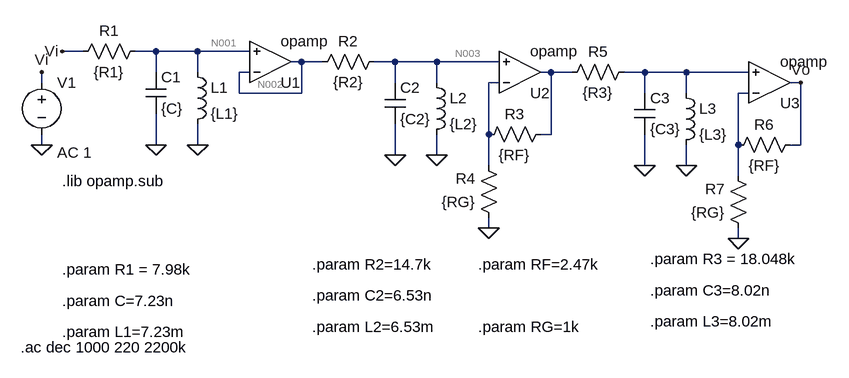
[diagram p0: schematic circuito_pasivo (copy).asc]
circuito_pasivo (copy).asc, the LTspice schematic file:
Version 4
SHEET 1 1120 680
WIRE -16 96 -48 96
WIRE 96 96 64 96
WIRE 160 96 96 96
WIRE 240 96 160 96
WIRE 320 112 304 112
WIRE 352 112 320 112
WIRE 464 112 432 112
WIRE 528 112 464 112
WIRE 624 112 528 112
WIRE 96 128 96 96
WIRE 160 128 160 96
WIRE 240 128 224 128
WIRE 704 128 688 128
WIRE 736 128 704 128
WIRE 848 128 816 128
WIRE 912 128 848 128
WIRE 1008 128 912 128
WIRE -80 144 -80 128
WIRE 464 144 464 112
WIRE 528 144 528 112
WIRE 624 144 608 144
WIRE 1088 144 1072 144
WIRE 224 160 224 128
WIRE 320 160 320 112
WIRE 320 160 224 160
WIRE 848 160 848 128
WIRE 912 160 912 128
WIRE 1008 160 992 160
WIRE 608 224 608 144
WIRE 704 224 704 128
WIRE 704 224 688 224
WIRE -80 240 -80 224
WIRE 96 240 96 192
WIRE 160 240 160 208
WIRE 992 240 992 160
WIRE 1088 240 1088 144
WIRE 1088 240 1072 240
WIRE 464 256 464 208
WIRE 528 256 528 224
WIRE 608 272 608 224
WIRE 848 272 848 224
WIRE 912 272 912 240
WIRE 992 288 992 240
WIRE 608 368 608 352
WIRE 992 384 992 368
FLAG 96 240 0
FLAG 160 240 0
FLAG 464 256 0
FLAG 528 256 0
FLAG 608 368 0
FLAG 848 272 0
FLAG 912 272 0
FLAG 992 384 0
FLAG 1088 144 Vo
FLAG -80 240 0
FLAG -80 128 Vi
FLAG -48 96 Vi
SYMBOL res 80 80 R90
WINDOW 0 0 56 VBottom 2
WINDOW 3 32 56 VTop 2
SYMATTR InstName R1
SYMATTR Value {R1}
SYMBOL cap 80 128 R0
SYMATTR InstName C1
SYMATTR Value {C}
SYMBOL ind 144 112 R0
SYMATTR InstName L1
SYMATTR Value {L1}
SYMBOL OpAmps\\opamp 272 176 M180
SYMATTR InstName U1
SYMBOL res 448 96 R90
WINDOW 0 0 56 VBottom 2
WINDOW 3 32 56 VTop 2
SYMATTR InstName R2
SYMATTR Value {R2}
SYMBOL cap 448 144 R0
SYMATTR InstName C2
SYMATTR Value {C2}
SYMBOL ind 512 128 R0
SYMATTR InstName L2
SYMATTR Value {L2}
SYMBOL OpAmps\\opamp 656 192 M180
SYMATTR InstName U2
SYMATTR SpiceLine Aol=1000K
SYMBOL res 704 208 R90
WINDOW 0 0 56 VBottom 2
WINDOW 3 32 56 VTop 2
SYMATTR InstName R3
SYMATTR Value {RF}
SYMBOL res 624 368 R180
WINDOW 0 36 76 Left 2
WINDOW 3 36 40 Left 2
SYMATTR InstName R4
SYMATTR Value {RG}
SYMBOL res 832 112 R90
WINDOW 0 0 56 VBottom 2
WINDOW 3 32 56 VTop 2
SYMATTR InstName R5
SYMATTR Value {R3}
SYMBOL cap 832 160 R0
SYMATTR InstName C3
SYMATTR Value {C3}
SYMBOL ind 896 144 R0
SYMATTR InstName L3
SYMATTR Value {L3}
SYMBOL OpAmps\\opamp 1040 208 M180
SYMATTR InstName U3
SYMATTR SpiceLine Aol=1000K
SYMBOL res 1088 224 R90
WINDOW 0 0 56 VBottom 2
WINDOW 3 32 56 VTop 2
SYMATTR InstName R6
SYMATTR Value {RF}
SYMBOL res 1008 384 R180
WINDOW 0 36 76 Left 2
WINDOW 3 36 40 Left 2
SYMATTR InstName R7
SYMATTR Value {RG}
SYMBOL voltage -80 128 R0
WINDOW 123 24 124 Left 2
WINDOW 39 0 0 Left 0
SYMATTR Value2 AC 1
SYMATTR InstName V1
SYMATTR Value ""
TEXT -48 296 Left 2 !.lib opamp.sub
TEXT -48 432 Left 2 !.param R1 = 7.98k
TEXT -48 480 Left 2 !.param C=7.23n
TEXT -48 528 Left 2 !.param L1=7.23m
TEXT 336 424 Left 2 !.param R2=14.7k
TEXT 336 472 Left 2 !.param C2=6.53n
TEXT 336 520 Left 2 !.param L2=6.53m
TEXT 592 424 Left 2 !.param RF=2.47k
TEXT 592 520 Left 2 !.param RG=1k
TEXT 856 416 Left 2 !.param R3 = 18.048k
TEXT 856 464 Left 2 !.param C3=8.02n
TEXT 856 512 Left 2 !.param L3=8.02m
TEXT -112 552 Left 2 !.ac dec 1000 220 2200k

The netlist it stands for:
* circuito_pasivo (copy).asc
R1 N001 Vi {R1}
C1 N001 0 {C}
L1 N001 0 {L1}
XU1 N002 N001 N002 opamp Aol=100K GBW=10Meg  ; pins invin noninvin out
R2 N003 N002 {R2}
C2 N003 0 {C2}
L2 N003 0 {L2}
XU2 N006 N003 N004 opamp Aol=1000K GBW=10Meg  ; pins invin noninvin out
R3 N004 N006 {RF}
R4 0 N006 {RG}
R5 N005 N004 {R3}
C3 N005 0 {C3}
L3 N005 0 {L3}
XU3 N007 N005 Vo opamp Aol=1000K GBW=10Meg  ; pins invin noninvin out
R6 Vo N007 {RF}
R7 0 N007 {RG}
V1 Vi 0 AC 1
.lib opamp.sub
.param R1 = 7.98k
.param C=7.23n
.param L1=7.23m
.param R2=14.7k
.param C2=6.53n
.param L2=6.53m
.param RF=2.47k
.param RG=1k
.param R3 = 18.048k
.param C3=8.02n
.param L3=8.02m
.ac dec 1000 220 2200k
.backanno
.end

* Results of the author's LTspice run, read from the files saved beside the schematic
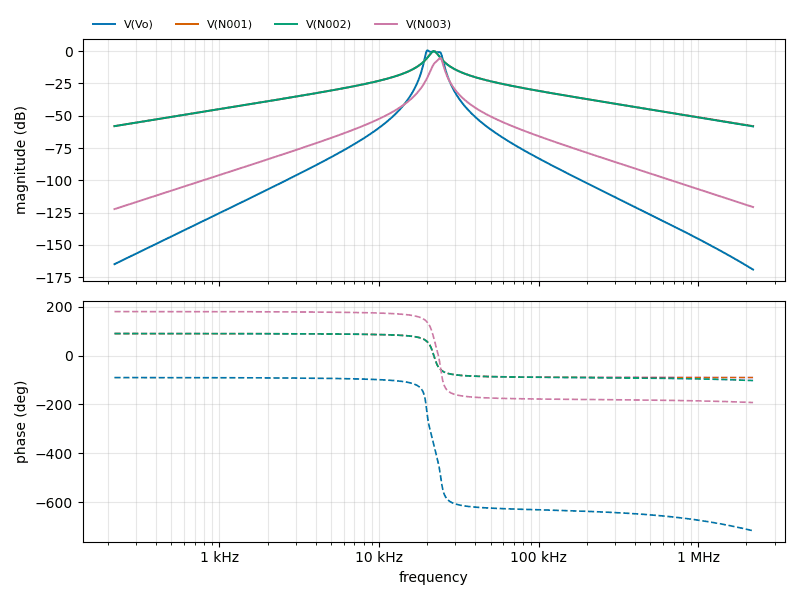
[diagram p1: AC Analysis of circuito_pasivo (copy).asc, plotted from the saved traces]
* AC Analysis, 1 run:
*   V(Vo): -164.90 dB at 220 Hz, -169.09 dB at 2.2 MHz, peak 0.60 dB at 20.06 kHz, 3 dB below the peak at 19.56 kHz and 24.54 kHz
*   V(N001): -58.04 dB at 220 Hz, -58.03 dB at 2.2 MHz, peak -0.00 dB at 22 kHz, 3 dB below the peak at 20.68 kHz and 23.44 kHz
*   V(N002): -58.04 dB at 220 Hz, -58.24 dB at 2.2 MHz, peak -0.00 dB at 22 kHz, 3 dB below the peak at 20.68 kHz and 23.44 kHz
*   V(N003): -122.28 dB at 220 Hz, -120.69 dB at 2.2 MHz, peak -5.35 dB at 24.12 kHz, 3 dB below the peak at 22.64 kHz and 24.9 kHz